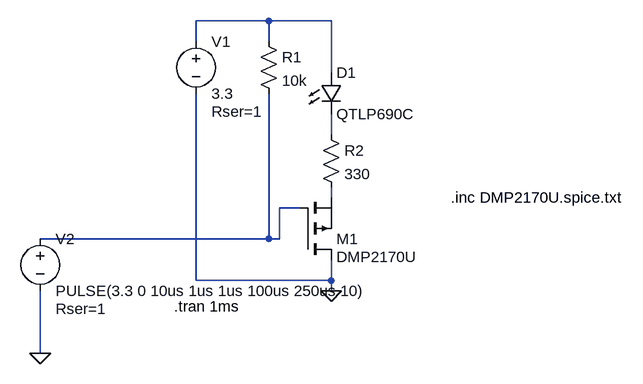
[diagram p0: schematic jfet_test.asc]
jfet_test.asc, the LTspice schematic file:
Version 4
SHEET 1 1140 680
WIRE 64 32 -48 32
WIRE 160 32 64 32
WIRE -48 64 -48 32
WIRE 64 64 64 32
WIRE 160 112 160 32
WIRE 160 208 160 176
WIRE 160 304 160 288
WIRE 112 320 80 320
WIRE 64 368 64 144
WIRE 64 368 -288 368
WIRE 80 368 80 320
WIRE 80 368 64 368
WIRE -48 432 -48 144
WIRE 160 432 160 400
WIRE 160 432 -48 432
WIRE 160 448 160 432
WIRE -288 544 -288 448
WIRE -272 544 -288 544
FLAG 160 448 0
FLAG -288 544 0
SYMBOL LED 144 112 R0
SYMATTR InstName D1
SYMATTR Value QTLP690C
SYMATTR Description Diode
SYMATTR Type diode
SYMBOL voltage -48 48 R0
WINDOW 123 0 0 Left 2
WINDOW 39 24 124 Left 2
SYMATTR InstName V1
SYMATTR Value 3.3
SYMATTR SpiceLine Rser=1
SYMBOL res 48 48 R0
SYMATTR InstName R1
SYMATTR Value 10k
SYMBOL res 144 192 R0
SYMATTR InstName R2
SYMATTR Value 330
SYMBOL voltage -288 352 R0
WINDOW 123 0 0 Left 2
WINDOW 39 24 124 Left 2
SYMATTR InstName V2
SYMATTR Value PULSE(3.3 0 10us 1us 1us 100us 250us 10)
SYMATTR SpiceLine Rser=1
SYMBOL pmos 112 400 M180
WINDOW 3 56 4 Left 2
SYMATTR InstName M1
SYMATTR Value DMP2170U
SYMATTR Prefix X
TEXT -82 472 Left 2 !.tran 1ms
TEXT 344 304 Left 2 !.inc DMP2170U.spice.txt

The netlist it stands for:
* jfet_test.asc
D1 N001 N002 QTLP690C
V1 N001 0 3.3 Rser=1
R1 N001 N004 10k
R2 N002 N003 330
V2 N004 0 PULSE(3.3 0 10us 1us 1us 100us 250us 10) Rser=1
XM1 0 N004 N003 DMP2170U  ; pins D G S
.model D D
.lib standard.dio
.tran 1ms
.inc DMP2170U.spice.txt
.backanno
.end